# EAGLE schematic fghgffgghhjjkk (EAGLE 9.5.1)
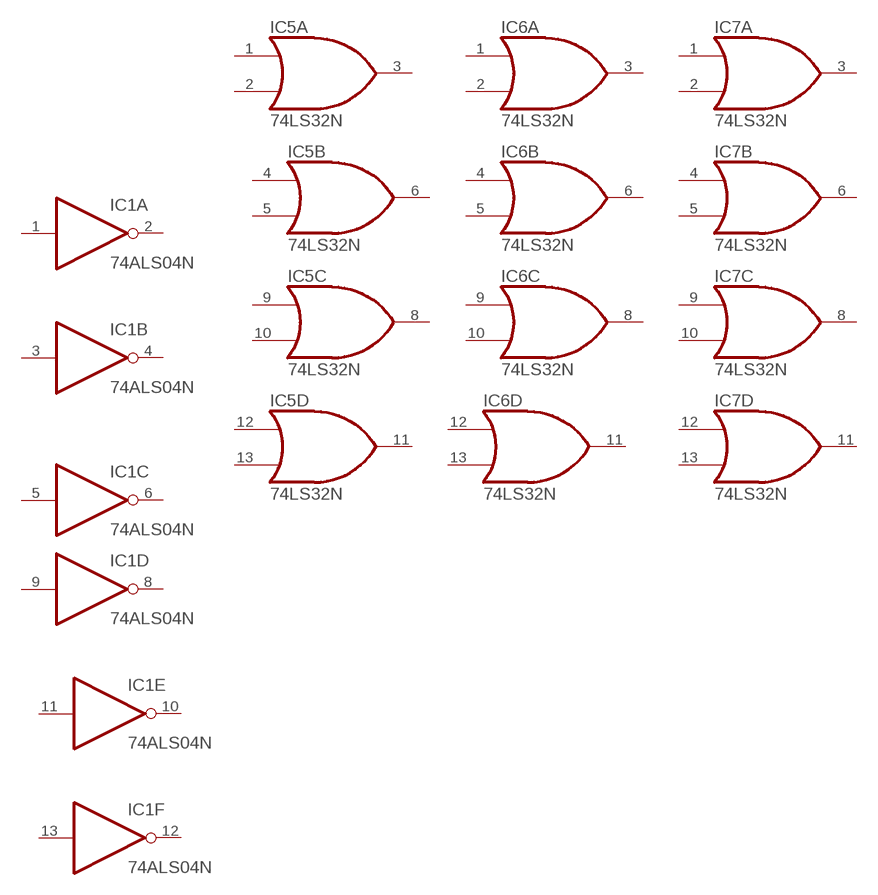
[diagram p0: schematic, sheet 1]

## Parts
IC1  74ALS04N  [DIL14]
IC5  74LS32N  [DIL14]
IC6  74LS32N  [DIL14]
IC7  74LS32N  [DIL14]
Unconnected: IC1.1(A:I) IC1.2(A:O) IC1.3(B:I) IC1.4(B:O) IC1.5(C:I) IC1.6(C:O) IC1.8(D:O) IC1.9(D:I) IC1.10(E:O) IC1.11(E:I) IC1.12(F:O) IC1.13(F:I) IC5.1(A:I0) IC5.2(A:I1) IC5.3(A:O) IC5.4(B:I0) IC5.5(B:I1) IC5.6(B:O) IC5.8(C:O) IC5.9(C:I0) IC5.10(C:I1) IC5.11(D:O) IC5.12(D:I0) IC5.13(D:I1) IC6.1(A:I0) IC6.2(A:I1) IC6.3(A:O) IC6.4(B:I0) IC6.5(B:I1) IC6.6(B:O) IC6.8(C:O) IC6.9(C:I0) IC6.10(C:I1) IC6.11(D:O) IC6.12(D:I0) IC6.13(D:I1) IC7.1(A:I0) IC7.2(A:I1) IC7.3(A:O) IC7.4(B:I0) IC7.5(B:I1) IC7.6(B:O) IC7.8(C:O) IC7.9(C:I0) IC7.10(C:I1) IC7.11(D:O) IC7.12(D:I0) IC7.13(D:I1)

## Power pins joined to a net without a drawn wire
GND: IC1.7(P:GND) IC5.7(P:GND) IC6.7(P:GND) IC7.7(P:GND)
VCC: IC1.14(P:VCC) IC5.14(P:VCC) IC6.14(P:VCC) IC7.14(P:VCC)

## Library data of the parts
IC1 = 74xx-us:74*04: Hex INVERTER
IC5-IC7 = 74xx-us:74*32: Quad 2-input OR gate